# EAGLE design shift_reg (EAGLE 9.6.2)
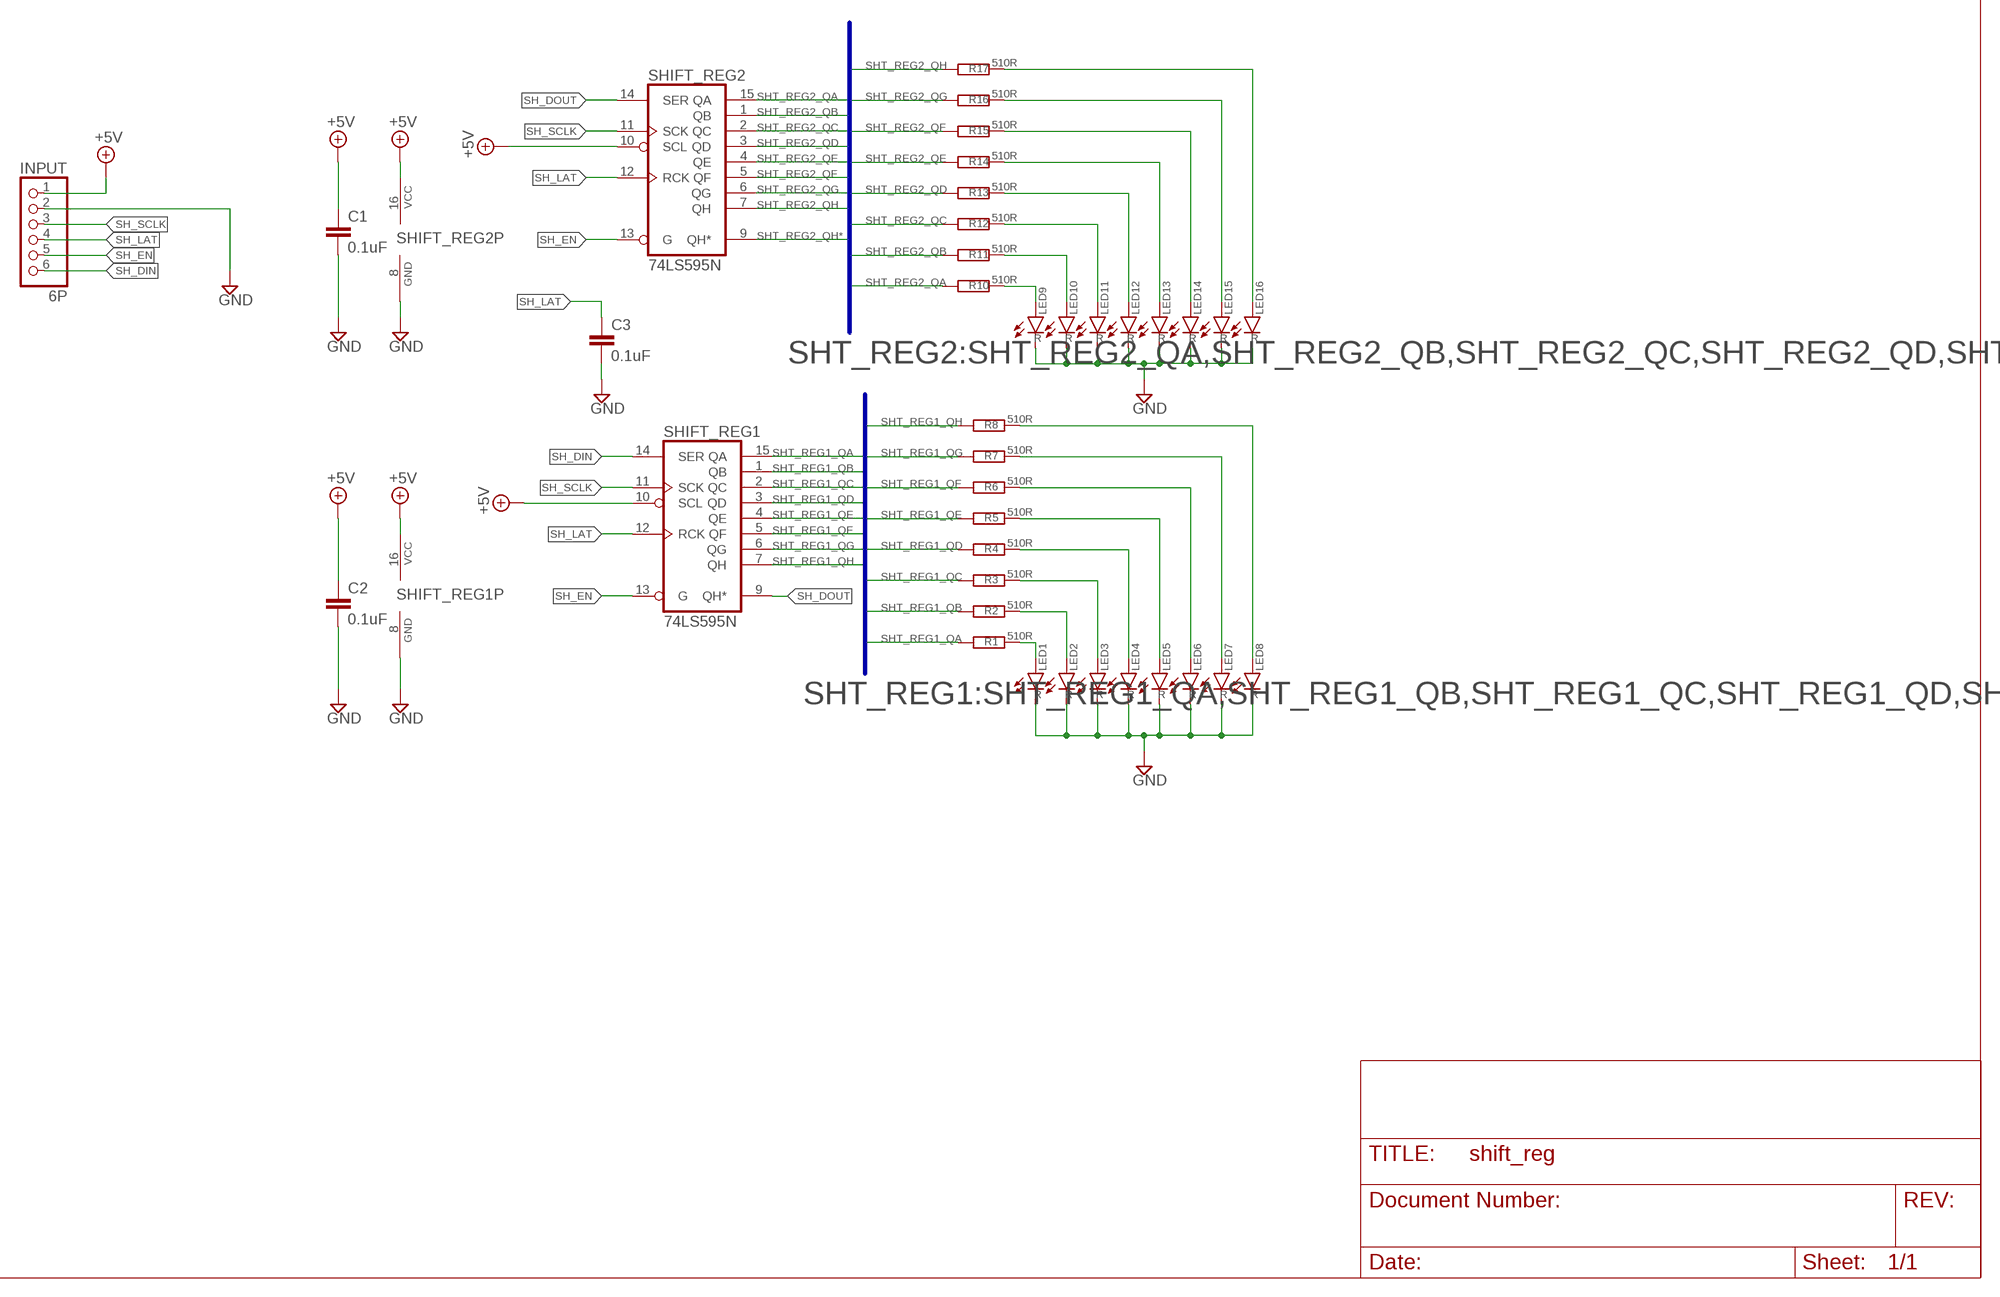
[diagram p0: schematic, sheet 1]

## Parts
C1  0.1uF  C-EU050-030X075  [C050-030X075]
C2  0.1uF  C-EU050-030X075  [C050-030X075]
C3  0.1uF  C-EU050-030X075  [C050-030X075]
INPUT  6P  PINHD-1X6/90  [1X06/90]
LED1  R  LED5MM  [LED5MM]
LED2  R  LED5MM  [LED5MM]
LED3  R  LED5MM  [LED5MM]
LED4  R  LED5MM  [LED5MM]
LED5  R  LED5MM  [LED5MM]
LED6  R  LED5MM  [LED5MM]
LED7  R  LED5MM  [LED5MM]
LED8  R  LED5MM  [LED5MM]
LED9  R  LED5MM  [LED5MM]
LED10  R  LED5MM  [LED5MM]
LED11  R  LED5MM  [LED5MM]
LED12  R  LED5MM  [LED5MM]
LED13  R  LED5MM  [LED5MM]
LED14  R  LED5MM  [LED5MM]
LED15  R  LED5MM  [LED5MM]
LED16  R  LED5MM  [LED5MM]
R1  510R  R-EU_0207/10  [0207/10]
R2  510R  R-EU_0207/10  [0207/10]
R3  510R  R-EU_0207/10  [0207/10]
R4  510R  R-EU_0207/10  [0207/10]
R5  510R  R-EU_0207/10  [0207/10]
R6  510R  R-EU_0207/10  [0207/10]
R7  510R  R-EU_0207/10  [0207/10]
R8  510R  R-EU_0207/10  [0207/10]
R10  510R  R-EU_0207/10  [0207/10]
R11  510R  R-EU_0207/10  [0207/10]
R12  510R  R-EU_0207/10  [0207/10]
R13  510R  R-EU_0207/10  [0207/10]
R14  510R  R-EU_0207/10  [0207/10]
R15  510R  R-EU_0207/10  [0207/10]
R16  510R  R-EU_0207/10  [0207/10]
R17  510R  R-EU_0207/10  [0207/10]
SHIFT_REG1  74LS595N  [DIL16]
SHIFT_REG2  74LS595N  [DIL16]

## Nets
+5V [POWER]: C1.1 C2.1 INPUT.1 SHIFT_REG1.10(SCL) SHIFT_REG1.16(VCC) SHIFT_REG2.10(SCL) SHIFT_REG2.16(VCC)
GND [POWER]: C1.2 C2.2 C3.2 INPUT.2 LED1.K(C) LED2.K(C) LED3.K(C) LED4.K(C) LED5.K(C) LED6.K(C) LED7.K(C) LED8.K(C) LED9.K(C) LED10.K(C) LED11.K(C) LED12.K(C) LED13.K(C) LED14.K(C) LED15.K(C) LED16.K(C) SHIFT_REG1.8(GND) SHIFT_REG2.8(GND)
N$1: LED1.A R1.2
N$2: LED2.A R2.2
N$3: LED3.A R3.2
N$4: LED4.A R4.2
N$5: LED5.A R5.2
N$6: LED6.A R6.2
N$7: LED7.A R7.2
N$8: LED8.A R8.2
N$9: LED9.A R10.2
N$10: LED10.A R11.2
N$11: LED11.A R12.2
N$12: LED12.A R13.2
N$13: LED13.A R14.2
N$15: LED14.A R15.2
N$16: LED15.A R16.2
N$17: LED16.A R17.2
SH_DIN: INPUT.6 SHIFT_REG1.14(SER)
SH_DOUT: SHIFT_REG1.9(QH*) SHIFT_REG2.14(SER)
SH_EN: INPUT.5 SHIFT_REG1.13(G) SHIFT_REG2.13(G)
SH_LAT: C3.1 INPUT.4 SHIFT_REG1.12(RCK) SHIFT_REG2.12(RCK)
SH_SCLK: INPUT.3 SHIFT_REG1.11(SCK) SHIFT_REG2.11(SCK)
SHT_REG1_QA: R1.1 SHIFT_REG1.15(QA)
SHT_REG1_QB: R2.1 SHIFT_REG1.1(QB)
SHT_REG1_QC: R3.1 SHIFT_REG1.2(QC)
SHT_REG1_QD: R4.1 SHIFT_REG1.3(QD)
SHT_REG1_QE: R5.1 SHIFT_REG1.4(QE)
SHT_REG1_QF: R6.1 SHIFT_REG1.5(QF)
SHT_REG1_QG: R7.1 SHIFT_REG1.6(QG)
SHT_REG1_QH: R8.1 SHIFT_REG1.7(QH)
SHT_REG2_QA: R10.1 SHIFT_REG2.15(QA)
SHT_REG2_QB: R11.1 SHIFT_REG2.1(QB)
SHT_REG2_QC: R12.1 SHIFT_REG2.2(QC)
SHT_REG2_QD: R13.1 SHIFT_REG2.3(QD)
SHT_REG2_QE: R14.1 SHIFT_REG2.4(QE)
SHT_REG2_QF: R15.1 SHIFT_REG2.5(QF)
SHT_REG2_QG: R16.1 SHIFT_REG2.6(QG)
SHT_REG2_QH: R17.1 SHIFT_REG2.7(QH)
SHT_REG2_QH*: SHIFT_REG2.9(QH*)

## Buses
SHT_REG1:SHT_REG1_QA,SHT_REG1_QB,SHT_REG1_QC,SHT_REG1_QD,SHT_REG1_QE,SHT_REG1_QF,SHT_REG1_QG,SHT_REG1_QH,SHT_REG1_QH*
SHT_REG2:SHT_REG2_QA,SHT_REG2_QB,SHT_REG2_QC,SHT_REG2_QD,SHT_REG2_QE,SHT_REG2_QF,SHT_REG2_QG,SHT_REG2_QH,SHT_REG2_QH*

## Library data of the parts
C1-C3 = rcl:C-EU: CAPACITOR, European symbol; SPICEPREFIX: C
INPUT = pinhead:PINHD-1X6: PIN HEADER
LED1-LED16 = led:LED: LED OSRAM: - CHIPLED LG R971, LG N971, LY N971, LG Q971, LY Q971, LO R971, LY R971 LH N974, LH R974 LS Q976, LO Q976, LY Q976 LO Q996 - Hyper CHIPLED LW Q18S LB Q993, LB Q99A, LB R99A - SideLED LS A670, LO A670, LY A670, LG A670, LP A670 LB A673, LV A673, LT A673, LW A673 LH A674 LY A675 LS A676, LA A676, LO A676, LY A676, LW A676 LS A679, LY A679, LG A679 - Hyper Micro SIDELED® LS Y876, LA Y876, LO Y876, LY Y876 LT Y87S - SmartLED LW L88C, LW L88S LB L89C, LB L89S, LG L890 LS L89K, LO L89K, LY L89K LS L896, LA L896, LO L896, LY L896 - TOPLED LS T670, LO T670, LY T670, LG T670, LP T670 LSG T670, LSP T670, LSY T670, LOP T670, LYG T670 LG T671, LOG T671, LSG T671 LB T673, LV T673, LT T673, LW T673 LH T674 LS T676, LA T676, LO T676, LY T676, LB T676, LH T676, LSB T676, LW T676 LB T67C, LV T67C, LT T67C, LS T67K, LO T67K, LY T67K, LW E67C LS E67B, LA E67B, LO E67B, LY E67B, LB E67C, LV E67C, LT E67C LW T67C LS T679, LY T679, LG T679 LS T770, LO T770, LY T770, LG T770, LP T770 LB T773, LV T773, LT T773, LW T773 LH T774 LS E675, LA E675, LY E675, LS T675 LS T776, LA T776, LO T776, LY T776, LB T776 LHGB T686 LT T68C, LB T68C - Hyper Mini TOPLED® LB M676 - Mini TOPLED Santana® LG M470 LS M47K, LO M47K, LY M47K Source: http://www.osram.convergy.de LUXEON: - LUMILED® LXK2-PW12-R00, LXK2-PW12-S00, LXK2-PW14-U00, LXK2-PW14-V00 LXK2-PM12-R00, LXK2-PM12-S00, LXK2-PM14-U00 LXK2-PE12-Q00, LXK2-PE12-R00, LXK2-PE12-S00, LXK2-PE14-T00, LXK2-PE14-U00 LXK2-PB12-K00, LXK2-PB12-L00, LXK2-PB12-M00, LXK2-PB14-N00, LXK2-PB14-P00, LXK2-PB14-Q00 LXK2-PR12-L00, LXK2-PR12-M00, LXK2-PR14-Q00, LXK2-PR14-R00 LXK2-PD12-Q00, LXK2-PD12-R00, LXK2-PD12-S00 LXK2-PH12-R00, LXK2-PH12-S00 LXK2-PL12-P00, LXK2-PL12-Q00, LXK2-PL12-R00 Source: www.luxeon.com KINGBRIGHT: KA-3528ASYC Source: www.kingbright.com
R1-R8 R10-R17 = rcl:R-EU_: RESISTOR, European symbol; SPICEPREFIX: R
SHIFT_REG1 SHIFT_REG2 = 74xx-us:74*595: 8-bit SHIFT REGISTER, output latch

## Net classes
0 default: width 0.254 mm, drill 0.406 mm, clearance 0.305 mm
1 POWER: width 0.406 mm, drill 0.406 mm, clearance 0.305 mm

## Board
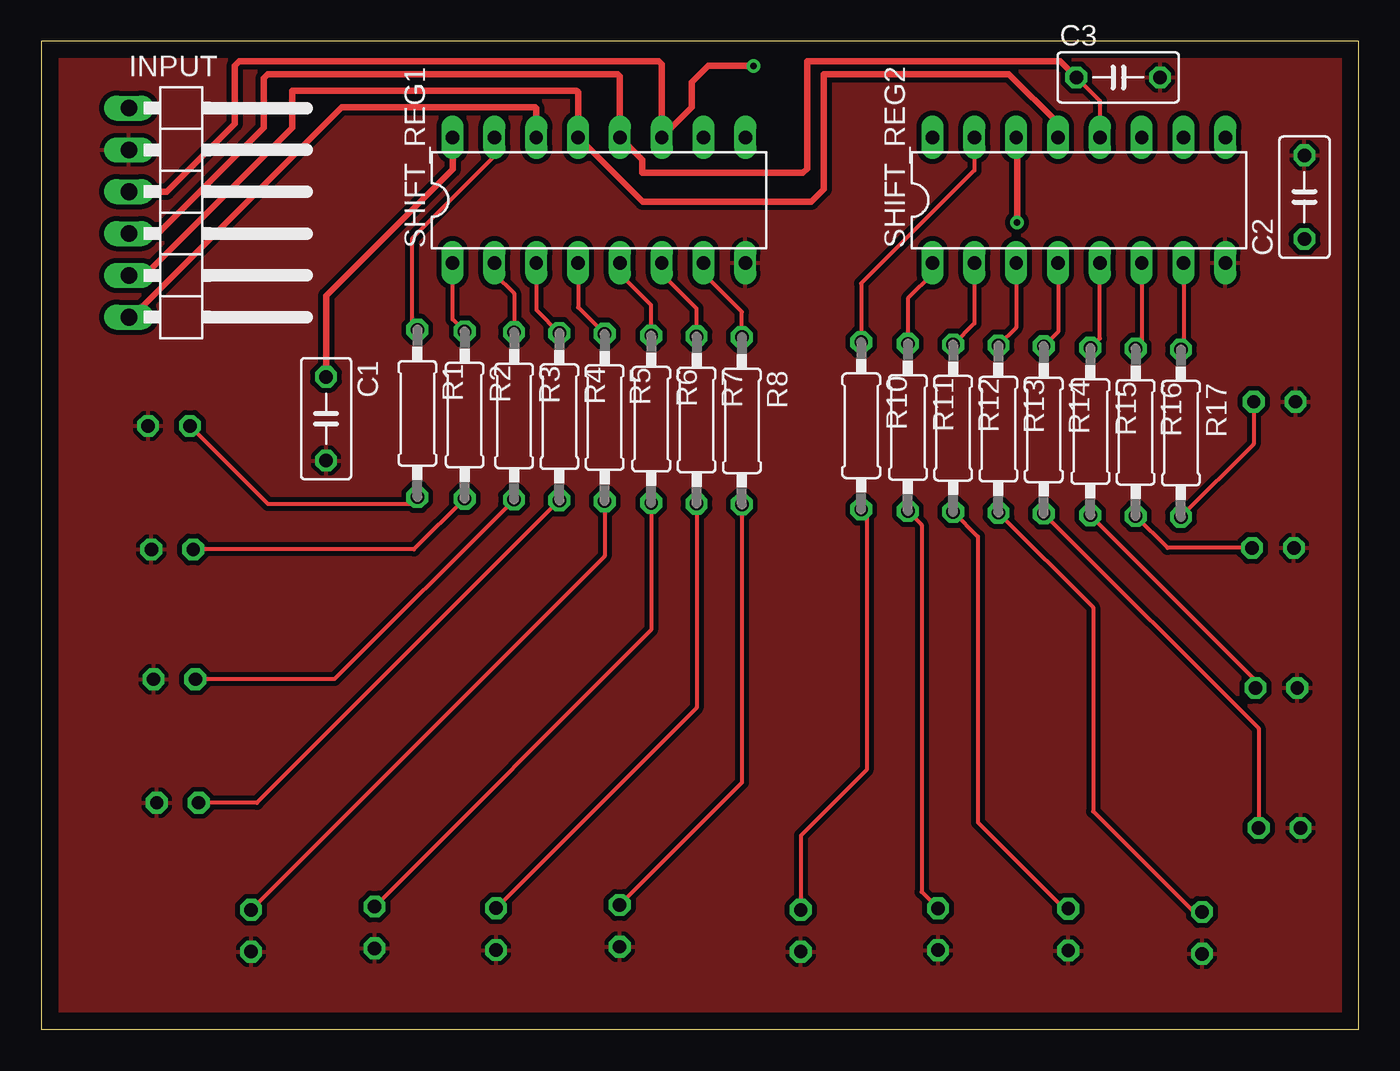
[diagram p1: board, top side]
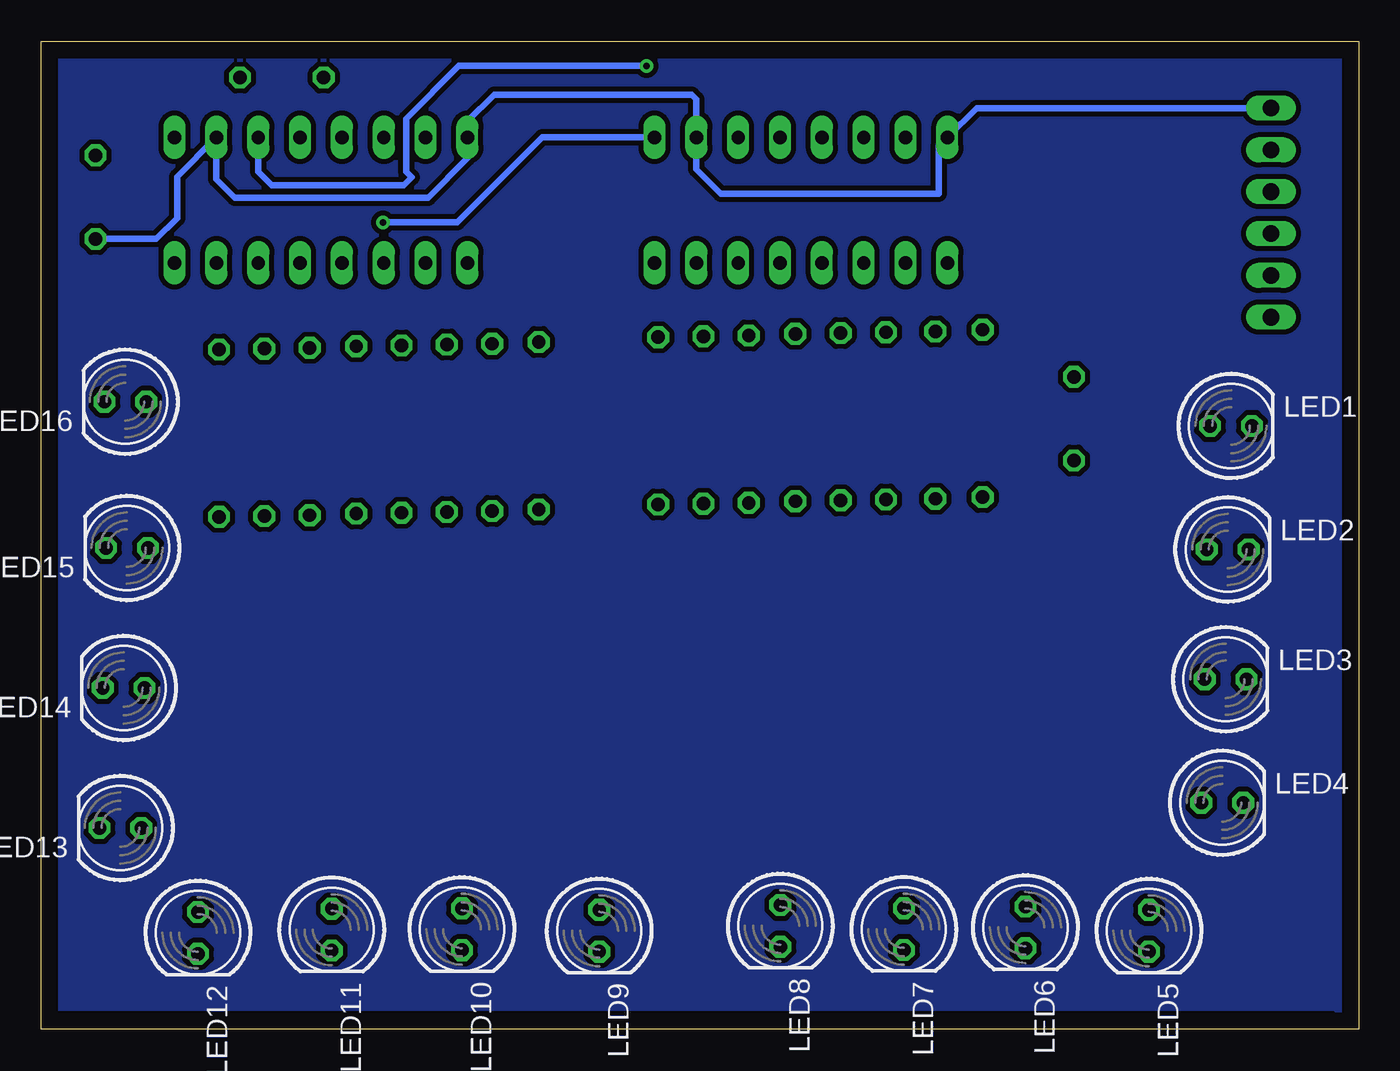
[diagram p2: board, bottom side, seen from below]

Size 80 x 60 mm. Coordinates in mm from the lower left corner, seen from the top.
Outline: 0,0 80,0 80,60 0,60 0,0
Copper layers (1*16): Top 0.035mm / dielectric 1.5mm / Bottom 0.035mm
Design rules "default": minimum track width 6mil, minimum drill 0.35mm, track to track 6mil, track to pad 6mil, pad to pad 6mil, via to via 6mil, smd to smd 6mil, copper to edge 40mil, drill to drill 6mil, minimum pad ring 10mil, minimum via ring 8mil, stop-mask expansion 4mil, vias tented up to drill 0mil, thermal gap 10mil

### Footprints (pad centres in the part's own frame; a part is rotated, then mirrored left to right if it is on the bottom)
C050-030X075 = drill 0.813 octagon: 1 -2.54,0; 2 2.54,0
1X06/90 = drill 1.016 long: 1 -6.35,-3.81; 2 -3.81,-3.81; 3 -1.27,-3.81; 4 1.27,-3.81; 5 3.81,-3.81; 6 6.35,-3.81
LED5MM = drill 0.813 octagon: A -1.27,0; K 1.27,0
0207/10 = drill 0.813 octagon: 1 -5.08,0; 2 5.08,0
DIL16 = drill 0.813 long: 1 -8.89,-3.81; 2 -6.35,-3.81; 3 -3.81,-3.81; 4 -1.27,-3.81; 5 1.27,-3.81; 6 3.81,-3.81; 7 6.35,-3.81; 8 8.89,-3.81; 9 8.89,3.81; 10 6.35,3.81; 11 3.81,3.81; 12 1.27,3.81; 13 -1.27,3.81; 14 -3.81,3.81; 15 -6.35,3.81; 16 -8.89,3.81

### Placement (x,y rotation side)
C1  17.3,37.08 270 top
C2  76.7,50.53 90 top
C3  65.39,57.8 0 top
INPUT  9.14,49.59 270 top
LED1  7.76,36.64 0 bottom
LED2  7.96,29.14 0 bottom
LED3  8.09,21.26 0 bottom
LED4  8.29,13.76 0 bottom
LED5  12.74,5.99 270 bottom
LED6  20.24,6.19 270 bottom
LED7  27.62,6.09 270 bottom
LED8  35.12,6.29 270 bottom
LED9  46.12,5.99 270 bottom
LED10  54.45,6.08 270 bottom
LED11  62.36,6.06 270 bottom
LED12  70.48,5.86 270 bottom
LED13  75.19,12.23 180 bottom
LED14  74.99,20.73 180 bottom
LED15  74.79,29.23 180 bottom
LED16  74.89,38.11 180 bottom
R1  22.84,37.4 270 top
R2  25.71,37.3 270 top
R3  28.71,37.25 270 top
R4  31.46,37.2 270 top
R5  34.21,37.15 270 top
R6  37.04,37.05 270 top
R7  39.79,37 270 top
R8  42.54,36.95 270 top
R10  49.79,36.65 270 top
R11  52.62,36.55 270 top
R12  55.37,36.5 270 top
R13  58.12,36.45 270 top
R14  60.87,36.4 270 top
R15  63.7,36.3 270 top
R16  66.45,36.25 270 top
R17  69.2,36.2 270 top
SHIFT_REG1  33.87,50.35 0 top
SHIFT_REG2  63.01,50.35 0 top

### Tracks (layer width: path | path; a pad name or v marks a point on that pad's centre or on a via)
+5V
  Top 0.406: SHIFT_REG1.16 24.98,52.23 17.3,44.55 C1.1
  Bottom 0.406: INPUT.1 23.2,55.94 SHIFT_REG1.16 25.5,53.64 25.5,50.75 38.75,50.75 40.22,52.22 SHIFT_REG1.10 40.22,56.47 40.5,56.75 52.5,56.75 54.12,55.13 SHIFT_REG2.16 54.12,52.88 56.5,50.5 68.25,50.5 69.36,51.61 SHIFT_REG2.10 71.75,51.77 71.75,49.25 73.01,47.99 C2.1
GND
  pour Top (isolate 0.254): 0.75,59.5 79.5,59.5 79.5,0.25 80,-0.25 1.25,-0.25 0.75,0.25 0.75,58.75 1,59 0.75,59.25
GND2
  pour Bottom (isolate 0.254): 0.75,59.25 79,59.25 79.5,58.75 79.5,1.5 79.25,1.25 1.5,1.25 0.75,0.5
N$1
  Top 0.254: R1.2 22.41,31.89 13.78,31.89 LED1.A
N$2
  Top 0.254: R2.2 22.63,29.14 LED2.A
N$3
  Top 0.254: R3.2 17.8,21.26 LED3.A
N$4
  Top 0.254: R4.2 13.1,13.76 LED4.A
N$5
  Top 0.254: R5.2 34.21,28.73 LED5.A
N$6
  Top 0.254: R6.2 37.04,24.26 LED6.A
N$7
  Top 0.254: R7.2 39.79,19.53 LED7.A
N$8
  Top 0.254: R8.2 42.54,14.98 LED8.A
N$9
  Top 0.254: R10.2 50.12,31.24 50.12,15.76 46.12,11.76 LED9.A
N$10
  Top 0.254: R11.2 53.45,30.64 53.45,8.35 LED10.A
N$11
  Top 0.254: R12.2 56.87,29.92 56.87,12.57 62.11,7.33 LED11.A
N$12
  Top 0.254: R13.2 63.87,25.62 63.87,13.24 69.98,7.13 LED12.A
N$13
  Top 0.254: R14.2 73.92,18.27 LED13.A
N$15
  Top 0.254: R15.2 73.72,21.2 LED14.A
N$16
  Top 0.254: LED15.A 68.39,29.23 R16.2
N$17
  Top 0.254: LED16.A 73.62,35.54 R17.2
SH_DIN
  Top 0.406: INPUT.6 5.49,43.24 18.25,56 30,56 30.06,55.94 SHIFT_REG1.14
SH_DOUT  (via drill 0.41)
  Top 0.406: v59.25,49 59.25,54.11 SHIFT_REG2.14
  Bottom 0.406: SHIFT_REG1.9 49.59,54.16 54.75,49 v59.25,49
SH_EN
  Top 0.406: INPUT.5 6.28,45.78 15.25,54.75 15.25,57 32.5,57 32.6,56.9 SHIFT_REG1.13 36.51,50.25 46.75,50.25 47.5,51 47.5,58 58.75,58 61.74,55.01 SHIFT_REG2.13
SH_LAT
  Top 0.254: C3.1 64.28,56.37 SHIFT_REG2.12
  Top 0.406: INPUT.4 7.07,48.32 13.5,54.75 13.5,57.75 13.75,58 35,58 35.14,57.86 SHIFT_REG1.12 36.5,52.8 36.5,52 46.25,52 46.5,52.25 46.5,58.78 61.87,58.78 C3.1
SH_SCLK  (via drill 0.41)
  Top 0.406: INPUT.3 7.61,50.86 11.75,55 11.75,58.5 12.03,58.78 37.5,58.78 37.68,58.6 SHIFT_REG1.11 39.5,55.98 39.5,57.5 40.5,58.5 v43.25,58.5
  Bottom 0.406: v43.25,58.5 54.63,58.5 57.83,55.3 57.83,52.08 57.5,51.75 58,51.25 66,51.25 66.82,52.07 SHIFT_REG2.11
SHT_REG1_QA
  Top 0.254: SHIFT_REG1.15 27.52,53.02 22.5,48 22.5,42.82 R1.1
SHT_REG1_QB
  Top 0.254: R2.1 24.98,43.11 24.98,45.88 SHIFT_REG1.1
SHT_REG1_QC
  Top 0.254: SHIFT_REG1.2 27.52,45.88 28.71,44.69 R3.1
SHT_REG1_QD
  Top 0.254: SHIFT_REG1.3 30.06,45.88 30.06,43.68 R4.1
SHT_REG1_QE
  Top 0.254: SHIFT_REG1.4 32.6,45.88 32.6,43.84 R5.1
SHT_REG1_QF
  Top 0.254: R6.1 37.04,43.98 35.14,45.88 SHIFT_REG1.5
SHT_REG1_QG
  Top 0.254: R7.1 39.79,43.77 37.68,45.88 SHIFT_REG1.6
SHT_REG1_QH
  Top 0.254: R8.1 42.54,43.56 40.22,45.88 SHIFT_REG1.7
SHT_REG2_QA
  Top 0.254: SHIFT_REG2.15 56.66,52.16 49.79,45.29 R10.1
SHT_REG2_QB
  Top 0.254: SHIFT_REG2.1 54.12,45.88 52.62,44.38 R11.1
SHT_REG2_QC
  Top 0.254: SHIFT_REG2.2 56.66,45.88 56.66,42.87 R12.1
SHT_REG2_QD
  Top 0.254: SHIFT_REG2.3 59.2,45.88 59.2,42.61 R13.1
SHT_REG2_QE
  Top 0.254: SHIFT_REG2.4 61.74,45.88 61.74,42.35 R14.1
SHT_REG2_QF
  Top 0.254: R15.1 64.28,41.96 64.28,45.88 SHIFT_REG2.5
SHT_REG2_QG
  Top 0.254: SHIFT_REG2.6 66.82,45.88 66.82,41.7 R16.1
SHT_REG2_QH
  Top 0.254: SHIFT_REG2.7 69.36,45.88 69.36,41.44 R17.1